# EAGLE design Tempidity Luxe (EAGLE 7.6.0)
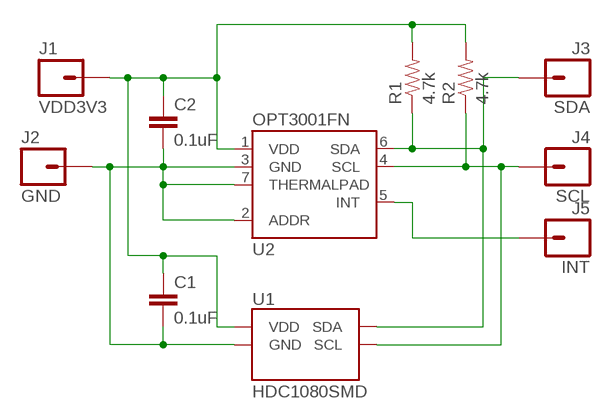
[diagram p0: schematic, sheet 1]

## Parts
C1  0.1uF  CAP0805  [0805]
C2  0.1uF  CAP0805  [0805]
J1  VDD3V3  M01PTH_NO_SILK_YES_STOP  [1X01_NO_SILK]
J2  GND  M01PTH_NO_SILK_YES_STOP  [1X01_NO_SILK]
J3  SDA  M01PTH_NO_SILK_YES_STOP  [1X01_NO_SILK]
J4  SCL  M01PTH_NO_SILK_YES_STOP  [1X01_NO_SILK]
J5  INT  M01PTH_NO_SILK_YES_STOP  [1X01_NO_SILK]
R1  4.7k  RESISTOR0805-RES  [0805]
R2  4.7k  RESISTOR0805-RES  [0805]
U1  HDC1080SMD  [TI-PWSON6-DMB]
U2  OPT3001FN  [TI-USON6-GND-PAD]

## Nets
GND: C1.2 C2.2 J2.1 U1.GND U2.2(ADDR) U2.3(GND) U2.7(THERMALPAD)
N$INT: J5.1 U2.5(INT)
SCL: J4.1 R2.1 U1.SCL U2.4(SCL)
SDA: J3.1 R1.1 U1.SDA U2.6(SDA)
VDD: C1.1 C2.1 J1.1 R1.2 R2.2 U1.VDD U2.1(VDD)

## Library data of the parts
C1 C2 = SparkFun-Capacitors:CAP: Capacitor Standard 0603 ceramic capacitor, and 0.1" leaded capacitor.
J1-J5 = SparkFun-Connectors:M01: Header 1 Standard 1-pin 0.1" header. Use with straight break away headers (SKU : PRT-00116), right angle break away headers (PRT-00553), swiss pins (PRT-00743), machine pins (PRT-00117), and female headers (PRT-00115). SMTSO-256-ET is a "flush mount" nut for a 4-40 screw. The older package used to be too tight, and did not allow it to sit properly thru the drill hit. The latest (0.165DIA) fits nice and snug.
R1 R2 = SparkFun-Resistors:RESISTOR: Resistor Basic schematic elements and footprints for 0603, 1206, and PTH resistors.
U1 = adam-sensors:HDC1080; PRODUCT_NAME: HDC1080; VENDOR_NAME: TI
U2 = adam-sensors:OPT3001: OPT3001.

## Board
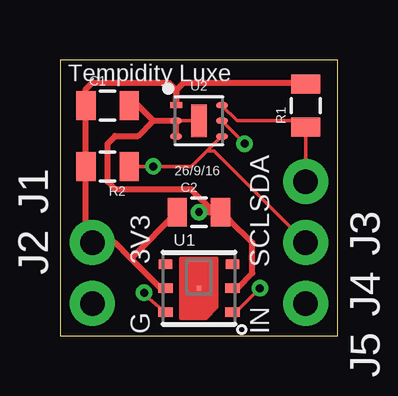
[diagram p1: board, top side]
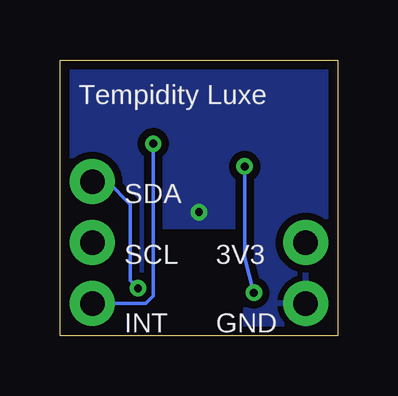
[diagram p2: board, bottom side, seen from below]

Size 11.58 x 11.51 mm. Coordinates in mm from the lower left corner, seen from the top.
Outline: 0,0 11.58,0 11.58,11.51 0,11.51 0,0
Copper layers (1*16): Top 0.0356mm / dielectric 1.5011mm / Bottom 0.0356mm
Design rules "oshpark-2layer": minimum track width 6mil, minimum drill 13mil, track to track 6mil, track to pad 6mil, pad to pad 6mil, via to via 6mil, smd to smd 6mil, copper to edge 15mil, drill to drill 6mil, minimum pad ring 7mil, minimum via ring 7mil, stop-mask expansion 2.5mil, vias tented up to drill 0mil, thermal gap 10mil
tRestrict: area 4.3,3.6 to 7.3,4.1
bRestrict: area 4.3,3.6 to 7.3,4.1

### Footprints (pad centres in the part's own frame; a part is rotated, then mirrored left to right if it is on the bottom)
0805 = smd 0.8 x 1.2: 1 -0.9,0; 2 0.9,0
1X01_NO_SILK = drill 1.016 pad 1.88: 1 0,0
TI-PWSON6-DMB = smd 0.6 x 0.4: GND 1.4,0; NC@1 -1.4,1; NC@6 1.4,1; SCL -1.4,-1; SDA 1.4,-1; VDD -1.4,0 | smd 0.2 x 0.2: NC@7 0,0
TI-USON6-GND-PAD = smd 0.5 x 0.25: 1 -0.95,0.65; 2 -0.95,0; 3 -0.95,-0.65; 4 0.95,-0.65; 5 0.95,0; 6 0.95,0.65 | smd 0.65 x 1.35: 7 0,0

### Placement (x,y rotation side)
C1  1.98,9.6 0 top
C2  5.79,5.16 0 top
J1  1.35,3.89 90 top
J2  1.35,1.35 90 top
J3  10.24,6.43 270 top
J4  10.24,3.89 270 top
J5  10.24,1.35 270 top
R1  10.24,9.6 90 top
R2  1.98,7.06 180 top
U1  5.79,1.98 0 top
U2  5.79,8.97 0 top

### Tracks (layer width: path | path; a pad name or v marks a point on that pad's centre or on a via)
GND  (via drill 0.33)
  Top 0.152: 7.06,4.84 6.74,5.16 C2.2 6.43,5.16 | 7.38,1.98 U1.GND | U2.7 U2.2
  Top 0.254: 7.38,1.98 8.01,2.62 8.01,3.89 7.06,4.84 | v5.79,5.16 6.43,5.16 5.47,6.11 2.3,6.11 1.98,6.43 1.98,8.01 2.3,8.33 3.25,8.33 3.89,8.97 | 3.89,8.97 U2.2 U2.3 | C1.2 3.25,9.6 3.89,8.97
  pour Bottom (isolate 0.305): 0.08,11.51 11.51,11.51 11.51,0.08 0.08,0.08
N$INT  (via drill 0.33)
  Top 0.152: v7.7,8.01 U2.5
  Bottom 0.152: v7.7,8.01 7.7,1.66 8.01,1.35 J5.1
SCL  (via drill 0.33)
  Top 0.152: 6.11,7.7 5.47,7.06 v3.89,7.06 R2.1 | 6.11,7.7 6.74,8.33 U2.4 | v3.51,1.79 3.57,1.66 U1.SCL | J4.1 6.43,7.7 6.11,7.7
  Bottom 0.152: v3.51,1.79 3.89,3.25 v3.89,7.06
SDA  (via drill 0.33)
  Top 0.152: v8.33,1.98 7.38,1.03 U1.SDA | J3.1 R1.1 10.24,8.97 7.38,8.97 6.74,9.6 U2.6
  Bottom 0.152: v8.33,1.98 8.65,2.3 8.65,5.47 9.6,6.43 J3.1
VDD
  Top 0.152: 4.2,1.98 U1.VDD | 4.84,5.16 C2.1 | 1.03,9.6 C1.1
  Top 0.254: 4.84,10.24 4.52,10.55 1.35,10.55 1.08,10.29 C1.1 R2.2 1.08,4.26 arc45 1.16,4.08 J1.1 2.3,3.89 2.93,3.25 | 4.84,10.24 U2.1 4.84,10.23 4.84,10.24 | 4.84,10.24 5.16,10.55 10.18,10.55 R1.2 | 4.2,1.98 2.93,3.25 | 2.93,3.25 2.99,3.25 C2.1

### Text on the board
tPlace: Tempidity Luxe | 26/9/16 | SDA | 3V3 | SCL | G | IN
bPlace: Tempidity Luxe | SDA | 3V3 | SCL | GND | INT